# EasyEDA Pro project laser_breakout_board.eprj

# Schematic Schematic2
Board Name: PCB2; Create Date: 2026-05-20; Page Name: P1; Project Name: laser_breakout_board; Schematic Name: Schematic2; Update Date: 2026-05-22; Company: EasyEDA.com; Page Size: A4; Version: V1.0
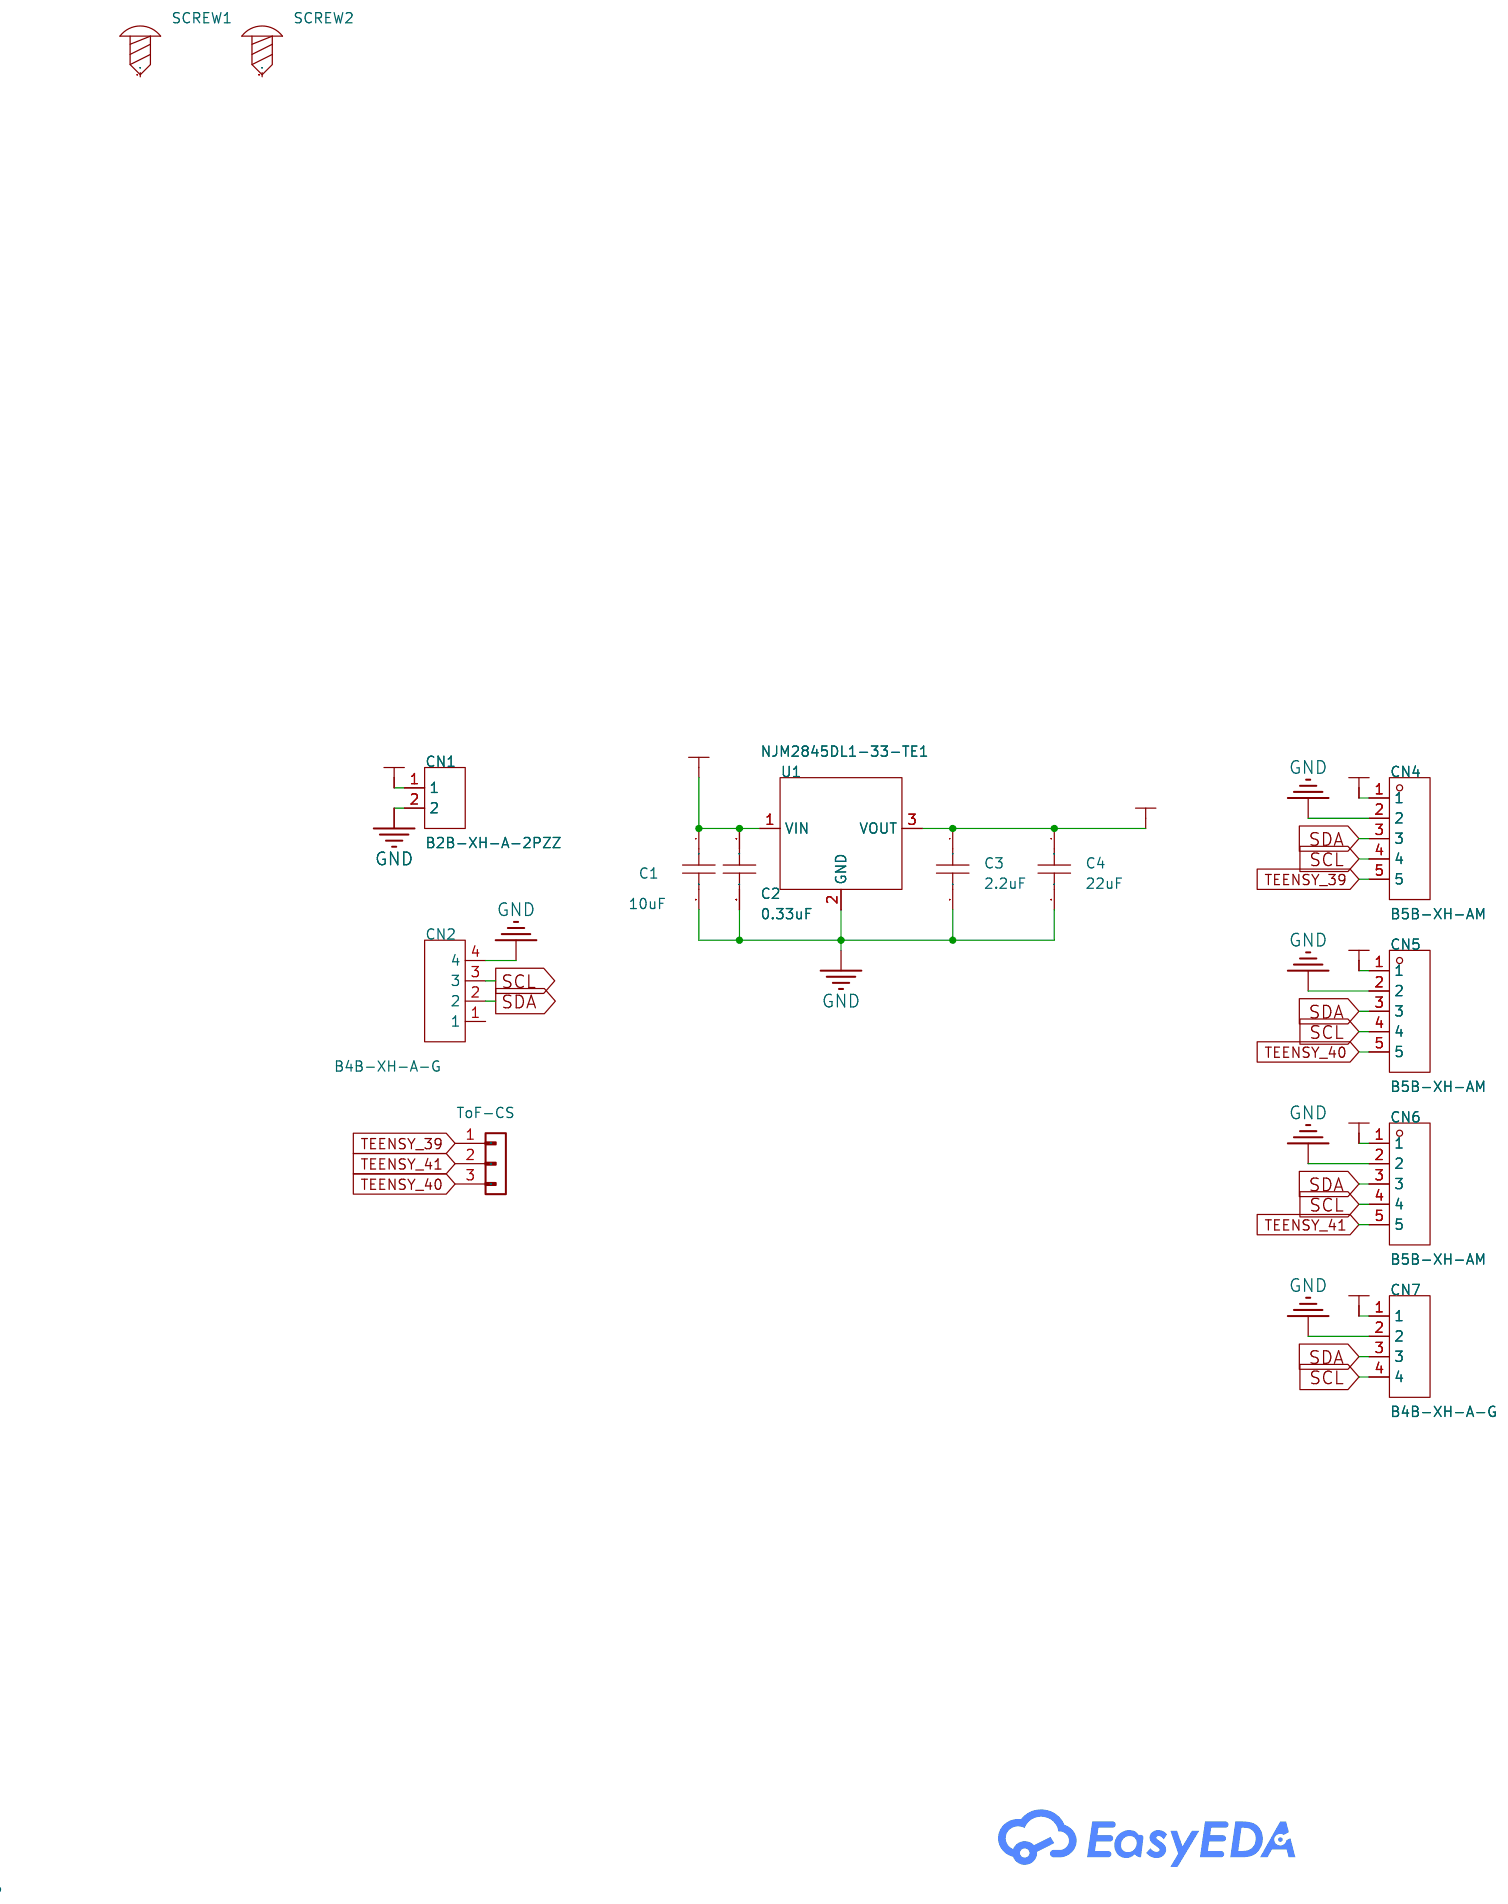
[diagram p0: schematic sheet]

## Parts
C1  10uF  [C0603]
C2  0.33uF  [C0603]
C3  2.2uF  [C0603]
C4  22uF  [C0603]
CN1  B2B-XH-A-2PZZ  [CONN-TH_B2B-XH-A-2PZZ]
CN2  B4B-XH-A-G  [CONN-TH_B4B-XH-A-G]
CN3  ToF-CS  [CONN-TH_3P-P2.50_BX-XH2.54-3PZZ]
CN4  B5B-XH-AM  [CONN-TH_B5B-XH-AM-LF-SN]
CN5  B5B-XH-AM  [CONN-TH_B5B-XH-AM-LF-SN]
CN6  B5B-XH-AM  [CONN-TH_B5B-XH-AM-LF-SN]
CN7  B4B-XH-A-G  [CONN-TH_B4B-XH-A-G]
SCREW1  -  [Screw-Hole-M2]
SCREW2  -  [Screw-Hole-M2]
U1  NJM2845DL1-33-TE1  [TO-252-3_L6.6-W6.1-P4.57-LS9.9-BR-CW]

## Library data of the parts
C1-C4 = CAP_0603: Supplier Footprint: 0603
CN1 = B2B-XH-A-2PZZ: LCSC Part Name: 1x2P 间距:2.54mm 直插 系列:XH; Supplier Part: C54444766; Manufacturer: BXCONN(宝讯); Supplier Footprint: 插件,P=2.54mm; JLCPCB Part Class: Extended Part; Datasheet: https://item.szlcsc.com/datasheet/B2B-XH-A-2PZZ/57781633.html; Supplier: LCSC; Pins Structure: 1x2P; Pitch: 2.54mm; Mounting Type: Through Hole; Reference Series: XH; Number of Pins: 2P; Number of Rows: 1; Number of PINs Per Row: 2; Current Rating: 2A; Contact Material: Brass; Contact Plating: Tin; Operating Temperature: -25℃~+85℃; Voltage Rating: 250V; Plastic Material: PA66; Flame Retardant Rating: UL94V-0; Color: White; Z-Height of the Board: 7mm; X-Length of Bottom Edge on Board (Spacing Line): 7.5mm; Y-Width of Bottom Edge on Board: 5.9mm
CN2 CN7 = B4B-XH-A-G: LCSC Part Name: 1x4P 间距:2.5mm 直插 系列:XH; Supplier Part: C594232; Manufacturer: JST; Supplier Footprint: 插件,P=2.5mm; JLCPCB Part Class: Extended Part; Datasheet: https://atta.szlcsc.com/upload/public/pdf/source/20201120/C594232_DD5B967B853D5C0FE2944642B90E06D1.pdf; Supplier: LCSC; Pins Structure: 1x4P; Pitch: 2.5mm; Mounting Style: Direct Insert; Reference Series: XH; Number of Pins: 4P; Number of Rows: 1; Number of PINs Per Row: 4; Current Rating (Max): 3A; Contact Material: Brass; Contact Plating: Gold; Operating Temperature Range: -25℃~+85℃; Rated Voltage (Max): 250V; Plastic Material: PA66; Flame Retardant Rating: UL94V-0; Supplementary Features: K-leg punch; Colour: White; Z-Height of the Board: 7mm; X-Length of Bottom Edge on Board (Spacing Line): 12.4mm; Y-Width of Bottom Edge on Board: 5.75mm
CN3 = B3B-XH-A(LF)(SN): Pins Structure:1x3P Pitch:2.5mm Mounting Type:Through Hole Reference Series:XH Number of Pins:3P Number of Rows:1 Number of PINs Per Row:3 Row Spacing:- Current Rating:3A Contact Material:Brass Contact Plating:Tin Operating Temperature:-25℃~+85℃ Operating; LCSC Part Name: 1x3P 间距:2.5mm 直插 系列:XH; Supplier Part: C144394; Manufacturer: JST; Supplier Footprint: 插件,P=2.5mm; JLCPCB Part Class: Extended Part; Datasheet: https://item.szlcsc.com/datasheet/B3B-XH-A(LF)(SN)/155726.html; Supplier: LCSC; Pins Structure: 1x3P; Pitch: 2.5mm; Mounting Type: Through Hole; Reference Series: XH; Number of Pins: 3P; Number of Rows: 1; Number of PINs Per Row: 3; Current Rating: 3A; Contact Material: Brass; Contact Plating: Tin; Operating Temperature: -25℃~+85℃; Voltage Rating: 250V; Plastic Material: PA66; Flame Retardant Rating: UL94V-0; Supplementary Features: K Pin; Color: White; Z-Height of the Board: 7mm; X-Length of Bottom Edge on Board (Spacing Line): 9.9mm; Y-Width of Bottom Edge on Board: 5.75mm
CN4-CN6 = B5B-XH-AM: LCSC Part Name: 1x5P 间距:2.5mm 直插 系列:XH; Supplier Part: C5306531; Manufacturer: JST; Supplier Footprint: 插件,P=2.5mm; JLCPCB Part Class: Extended Part; Datasheet: https://item.szlcsc.com/datasheet/B5B-XH-AM/6058836.html; Supplier: LCSC; Pins Structure: 1x5P; Pitch: 2.5mm; Mounting Type: Through Hole; Reference Series: XH; Number of Pins: 5P; Number of Rows: 1; Number of PINs Per Row: 5; Current Rating: 3A; Contact Material: Brass; Contact Plating: Tin; Operating Temperature: -25℃~+85℃; Voltage Rating: 250V; Plastic Material: PA66; Flame Retardant Rating: UL94V-0; Supplementary Features: K Pin；with locating pin; Color: White; Z-Height of the Board: 7mm; X-Length of Bottom Edge on Board (Spacing Line): 14.9mm; Y-Width of Bottom Edge on Board: 5.75mm
SCREW1 SCREW2 = Screw-Hole-M2: Supplier Footprint: 插件
U1 = NJM2845DL1-33-TE1: LCSC Part Name: 3.3V 800mA 14V; Supplier Part: C3747109; Manufacturer: Nisshinbo; Supplier Footprint: TO-252; JLCPCB Part Class: Extended Part; Datasheet: https://item.szlcsc.com/datasheet/NJM2845DL1-33-TE1/4314636.html; Supplier: LCSC; Output Type: Fixed; Voltage - Supply: 14V; Output Voltage: 3.3V; Output Current: 800mA; Power Supply Rejection Ratio (PSRR): 75dB@(1kHz); Voltage Dropout: 180mV@(500mA); standby current: 400uA; Noise: 45uVrms; Features: Over Current Protection；Over Temperature Protection; Operating Temperature: -40℃~+85℃@(Ta); Output Configuration: Positive; Number of Outputs: 1

## Nets
3.3V: C3.1 C4.1 CN4.1 CN5.1 CN6.1 CN7.1 U1.3(VOUT)
GND: C1.2 C2.2 C3.2 C4.2 CN1.2 CN2.4 CN4.2 CN5.2 CN6.2 CN7.2 U1.2(GND)
VIN: C1.1 C2.1 CN1.1 U1.1(VIN)
SCL: CN2.3 CN4.4 CN5.4 CN6.4 CN7.4
SDA: CN2.2 CN4.3 CN5.3 CN6.3 CN7.3
TEENSY_39: CN3.1(Pin) CN4.5
TEENSY_40: CN3.3(Pin) CN5.5
TEENSY_41: CN3.2(Pin) CN6.5

Not connected (* = marked no-connect by the designer): CN2 1; SCREW1 1; SCREW2 1

# Board PCB2
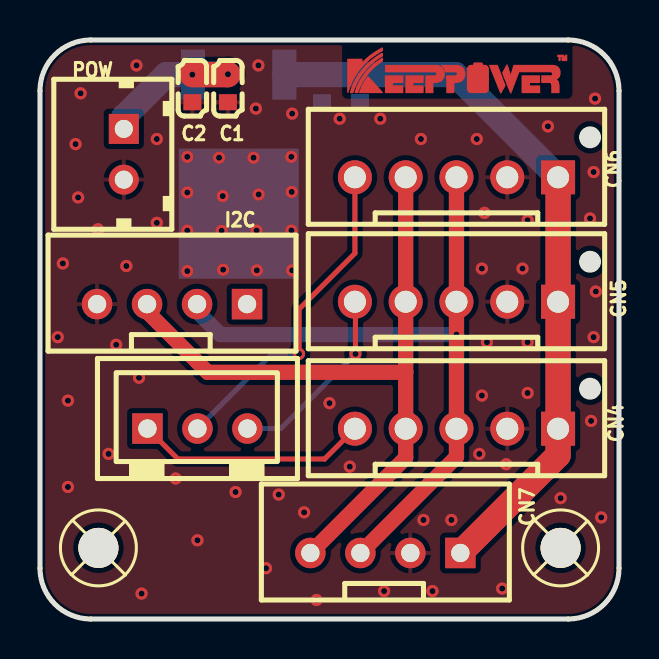
[diagram p1: board, top side]
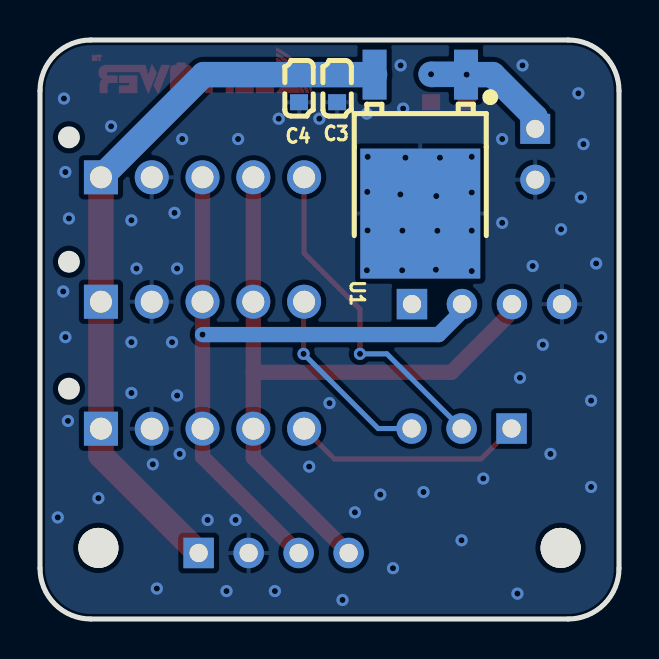
[diagram p2: board, bottom side, seen from below]

Outline 28.96 x 28.96 mm; copper layers: Top Layer, Bottom Layer. Coordinates in mm from the lower left corner of the outline.
Outline path: 0,26.42 0,2.54 arc(0.74,0.74) 2.54,0 26.42,0 arc(28.21,0.74) 28.96,2.54 28.96,26.42 arc(28.21,28.21) 26.42,28.96 2.54,28.96 arc(0.74,28.21) 0,26.42
Stack: Top Layer 0.035mm / Dielectric1 1.51mm FR4 er 4.5 / Bottom Layer 0.035mm

## Design rules (mm)
template: JLCPCB Capability(Two Layers Board)
spacing copperThickness1oz (default): track to track 0.102, other pairs 0.152 to 0.3
spacing copperThickness2oz: track to track 0.203, other pairs 0.152 to 0.3
track width copperThickness1oz (default): min 0.127, default 0.254, max 2.54
track width copperThickness2oz: min 0.203, default 0.254, max 2.54
differential pair differentialPair (default): width min 0.127, default 0.254, max 2.54; gap min 0.152, default 0.152
via viaSize (default): diameter min 0.5, default 0.61, max 10; hole min 0.3, default 0.305, max 6.3

## Placement (name value [footprint] x y rotation side)
C1  10uF  [C0603]  9.4 26.54 270 top
C2  0.33uF  [C0603]  7.62 26.54 270 top
C3  2.2uF  [C0603]  14.1 26.54 270 bottom
C4  22uF  [C0603]  16 26.54 270 bottom
CN3  ToF-CS  [CONN-TH_3P-P2.50_BX-XH2.54-3PZZ]  7.87 9.53 0 top
CN4  B5B-XH-AM  [CONN-TH_B5B-XH-AM-LF-SN]  20.83 9.52 0 top
CN5  B5B-XH-AM  [CONN-TH_B5B-XH-AM-LF-SN]  20.83 15.87 0 top
CN6  B5B-XH-AM  [CONN-TH_B5B-XH-AM-LF-SN]  20.83 22.09 0 top
CN7  B4B-XH-A-G  [CONN-TH_B4B-XH-A-G]  17.27 3.3 180 top
I2C  B4B-XH-A-G  [CONN-TH_B4B-XH-A-G]  6.6 15.75 180 top
POW  B2B-XH-A-2PZZ  [CONN-TH_B2B-XH-A-2PZZ]  4.19 23.24 270 top
SCREW1  -  [Screw-Hole-M2]  2.92 3.56 0 top
SCREW2  -  [Screw-Hole-M2]  26.03 3.56 0 top
U1  NJM2845DL1-33-TE1  [TO-252-3_L6.6-W6.1-P4.57-LS9.9-BR-CW]  9.94 23.75 90 bottom

## Footprints (pads in the part's own frame, mm; a bottom-side part is the same pattern mirrored in y, then rotated)
C0603
  rect 0.8x0.9 smd: 1(-0.7,0) 2(0.7,0)
CONN-TH_3P-P2.50_BX-XH2.54-3PZZ
  rect 1.524x1.524 hole 0.914: 1(-2.5,0)
  round 1.524 hole 0.914: 2(0,0) 3(2.5,0)
CONN-TH_B2B-XH-A-2PZZ
  rect 1.5x1.5 hole 0.9: 1(-1.27,0)
  round 1.5 hole 0.9: 2(1.27,0)
CONN-TH_B4B-XH-A-G
  rect 1.524x1.524 hole 0.914: 1(-3.75,0)
  round 1.524 hole 0.914: 2(-1.25,0) 3(1.25,0) 4(3.75,0)
CONN-TH_B5B-XH-AM-LF-SN
  rect 1.7x1.7 hole 1.1: 1(5.08,0)
  round 1.7 hole 1.1: 2(2.54,0) 3(0,0) 4(-2.54,0) 5(-5.08,0)
Screw-Hole-M2
  round 2 hole 2: 1(0,0)
TO-252-3_L6.6-W6.1-P4.57-LS9.9-BR-CW
  rect 2.5x1.2 smd: 1(3.475,-2.286) 3(3.475,2.286)
  rect 6.5x6 smd: 2(-3.475,0)

## Nets
3.3V: C3.1 C4.1 CN4.1 CN5.1 CN6.1 CN7.1 U1.3
GND: C1.2 C2.2 C3.2 C4.2 CN4.2 CN5.2 CN6.2 CN7.2 I2C.4 POW.2 U1.2
VIN: C1.1 C2.1 POW.1 U1.1
SCL: CN4.4 CN5.4 CN6.4 CN7.4 I2C.3
SDA: CN4.3 CN5.3 CN6.3 CN7.3 I2C.2
TEENSY_39: CN3.1 CN4.5
TEENSY_40: CN3.3 CN5.5
TEENSY_41: CN3.2 CN6.5

Pads without a net: I2C 1; SCREW1 1; SCREW2 1

## Via types
v1: diameter 0.61, hole 0.305, Top Layer to Bottom Layer, 77 vias

## Routing (per net, layer and track width the routed paths; a pad name or vN(x,y) marks a point on that pad's centre or on a via; arc(x,y) is an arc through that point)
3.3V: length 36.6
  Top Layer w1.27: CN7.1 25.91,8.19 CN4.1 CN5.1 CN6.1
  Bottom Layer w1.27: CN6.1 20.77,27.22 U1.3
GND:
  vias: v1(0.89,14.1) v1(1.14,17.78) v1(1.4,10.92) v1(1.4,6.6) v1(1.78,23.75) v1(1.91,21.08) v1(2.03,26.29) v1(2.9,19.49) v1(3.43,8.26) v1(3.81,13.72) v1(4.32,17.65) v1(4.83,27.69) v1(4.95,12.06) v1(5.08,1.27) v1(5.84,24) v1(5.84,19.81) v1(6.79,7.03) v1(7.37,23.11) v1(7.37,21.33) v1(7.37,19.42) v1(7.37,17.4) v1(7.87,3.94) v1(8.96,23.07) v1(9.14,21.15) v1(9.08,19.42) v1(9.16,17.47) v1(9.78,6.35) v1(10.68,23.07) v1(10.79,25.53) v1(10.83,19.42) v1(10.85,17.44) v1(10.92,27.69) v1(10.93,21.23) v1(11.3,2.54) v1(11.94,6.22) v1(12.61,25.27) v1(12.57,23.11) v1(12.59,21.36) v1(12.57,19.43) v1(12.61,17.44) v1(13.21,5.33) v1(13.83,0.95) v1(14.48,10.8) v1(14.99,25.02) v1(15.49,7.62) v1(17.02,25.02) v1(17.21,1.4) v1(19.05,24) v1(19.18,4.95) v1(19.63,1.4) v1(20.57,4.95) v1(21.84,24) v1(21.97,8.26) v1(22.1,17.53) v1(22.1,11.18) v1(22.23,20.31) v1(22.35,13.84) v1(23.11,1.52) v1(23.31,7.74) v1(24.13,17.53) v1(24.38,19.94) v1(24.38,13.84) v1(24.38,11.3) v1(25.4,24.64) v1(26.03,6.04) v1(27.51,20.03) v1(27.56,9.91) v1(27.69,22.35) v1(27.69,14.1) v1(27.76,26.03) v1(27.79,16.38) v1(28.07,5.08)
VIN: length 8.5
  Top Layer w1.27: v1(7.62,27.22) 9.38,27.22 v1(9.4,27.24)
  Bottom Layer w1.27: 4.19,24.51 4.19,25.09 6.32,27.22 v1(7.62,27.22) U1.1 7.67,27.24 v1(9.4,27.24)
SCL: length 35.3
  Top Layer w0.762: 18.29,12.34 CN4.4 18.29,8.07 CN7.4 ; 18.29,12.34 CN5.4 CN6.4 ; 18.29,12.34 8.38,12.34 5.35,15.37 I2C.3
SDA: length 34.6
  Top Layer w0.762: CN6.3 CN5.3 v1(20.83,14.22) CN4.3 20.83,8.11 CN7.3
  Bottom Layer w0.762: v1(20.83,14.22) 9.02,14.22 7.85,15.39 I2C.2
TEENSY_39: length 11.6
  Top Layer w0.254: CN3.1 6.9,8 14.23,8 CN4.5
TEENSY_40: length 9.6
  Top Layer w0.254: v1(15.78,13.26) 15.78,15.84 CN5.5
  Bottom Layer w0.254: CN3.3 12.04,9.53 v1(15.78,13.26)
TEENSY_41: length 16.6
  Top Layer w0.254: v1(12.95,13.26) 12.95,15.49 15.75,18.29 CN6.5
  Bottom Layer w0.254: CN3.2 11.61,13.26 v1(12.95,13.26)

## Copper pours and planes (outline as drawn; the poured copper is in the pictures)
GND on Top Layer: -3.56,30.99 33.66,30.99 33.66,-2.16 -3.56,-2.16
GND on Bottom Layer: -3.94,30.1 32.89,30.1 32.89,-2.54 -3.94,-2.54

Small or netless copper shapes (teardrops, artwork), in the pictures only: 13 on Top Layer
